# EAGLE design motor_updated_v2.0 (EAGLE 7.5.0)
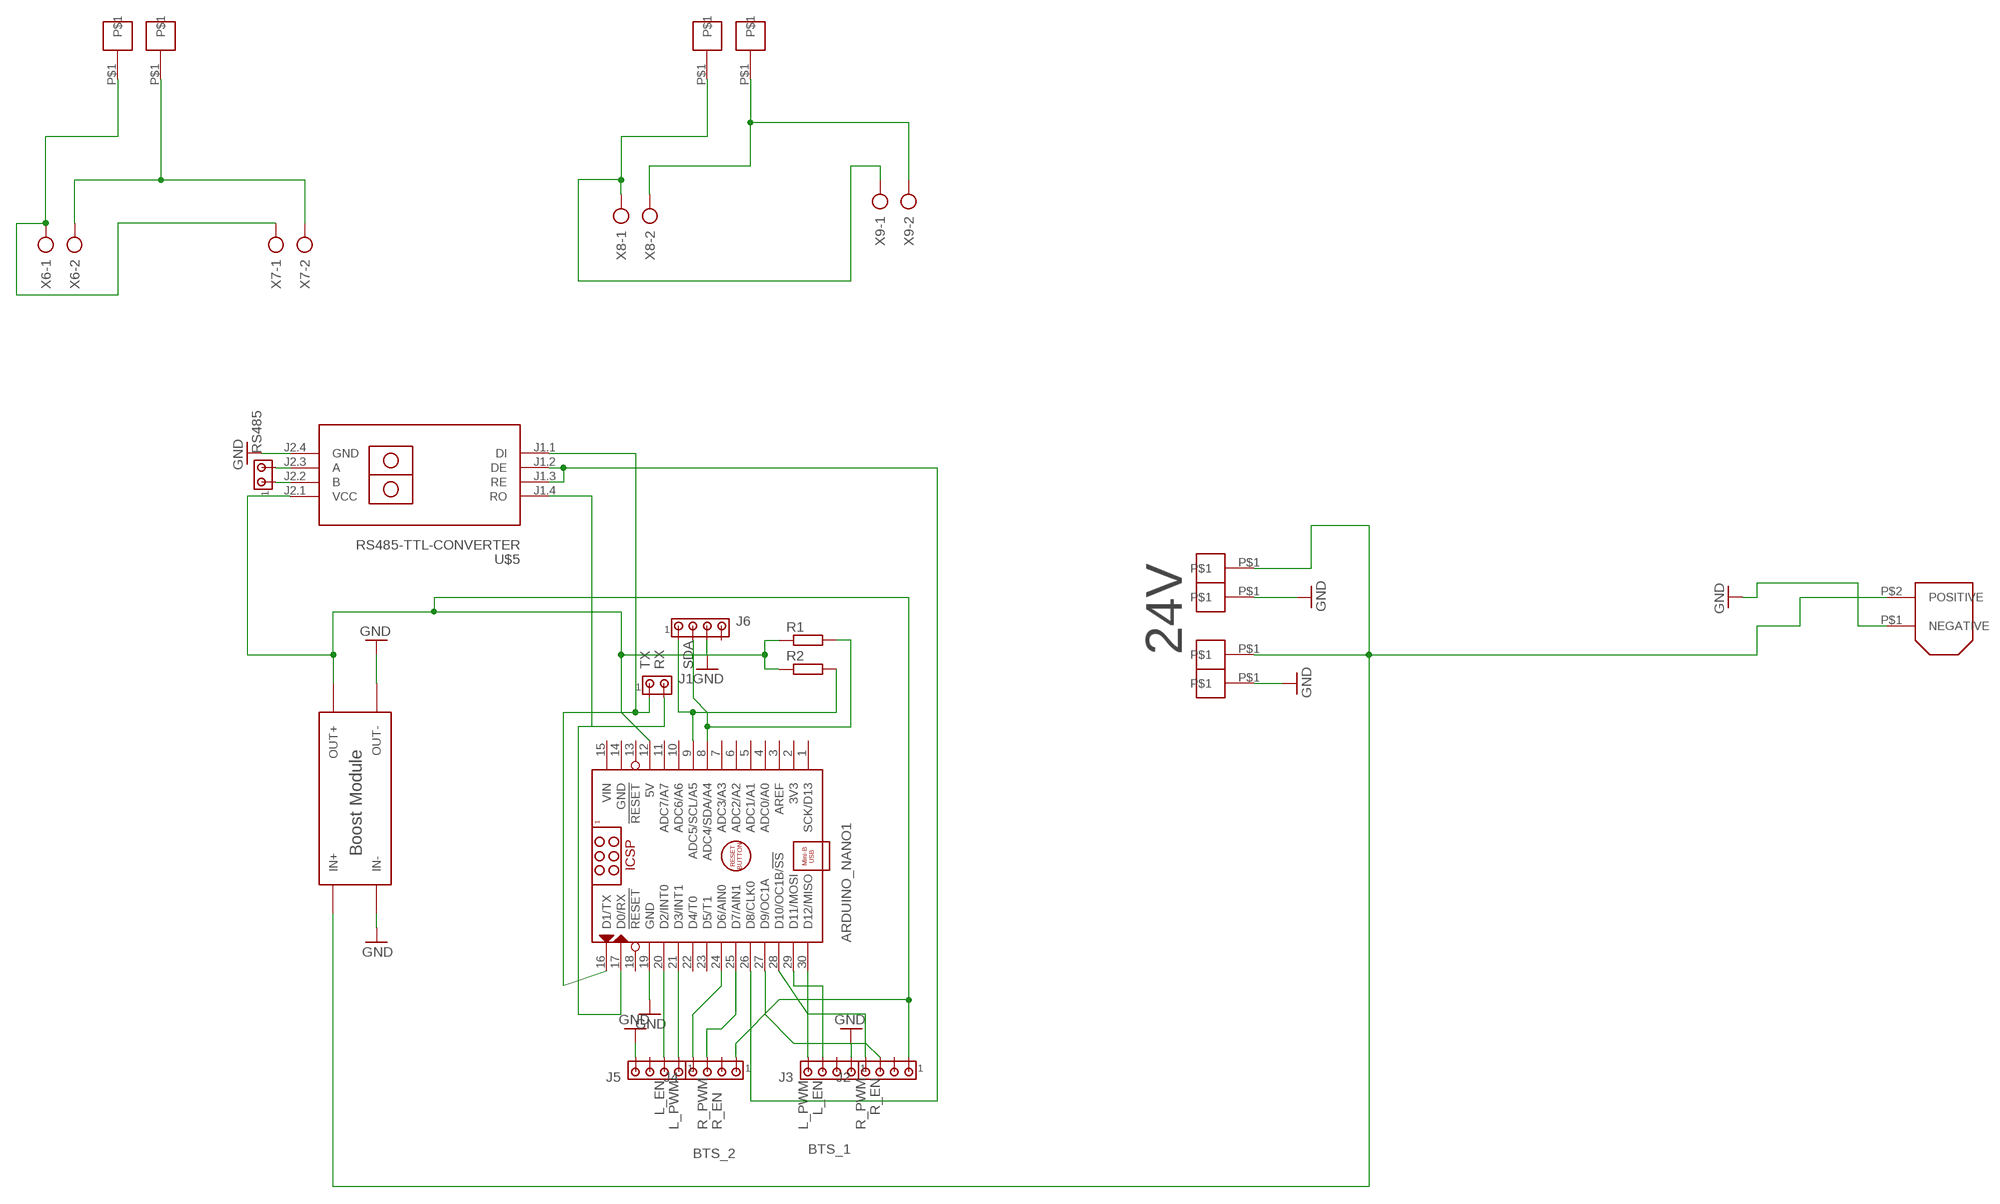
[diagram p0: schematic, sheet 1]

## Parts
ARDUINO_NANO1  ARDUINO_NANO  [ARDUINO_NANO]
J1  MTA02-100  [10X02MTA]
J2  MTA04-100  [10X04MTA]
J3  MTA04-100  [10X04MTA]
J4  MTA04-100  [10X04MTA]
J5  MTA04-100  [10X04MTA]
J6  MTA04-100  [10X04MTA]
R1  R-EU_0204/7  [0204/7]
R2  R-EU_0204/7  [0204/7]
RS485  MTA02-100  [10X02MTA]
U$4  BOOST_MODULE  [BOOST_MODULE]
U$5  RS485-TTL-CONVERTER  [RS485-TTL-CONVERTER]
U$6  VIA  [VIA]
U$7  XT60  [CONNECTOR]
U$8  VIA  [VIA]
U$9  VIA  [VIA]
U$12  VIA  [VIA]
U$13  VIA  [VIA]
U$14  VIA  [VIA]
U$15  VIA  [VIA]
U$23  VIA  [VIA]
X6  AK300/2  [AK300/2]
X7  AK300/2  [AK300/2]
X8  AK300/2  [AK300/2]
X9  AK300/2  [AK300/2]

## Nets
GND: ARDUINO_NANO1.19(GND) J3.1 J5.4 J6.3 U$4.IN- U$4.OUT- U$5.J2.4(GND) U$6.P$1 U$7.P$1(NEGATIVE) U$9.P$1
N$2: ARDUINO_NANO1.12(5V) J2.1 J4.1 R1.1 R2.1 U$4.OUT+ U$5.J2.1(VCC)
N$4: ARDUINO_NANO1.9(ADC5/SCL/A5) J6.1 R2.2
N$5: ARDUINO_NANO1.20(D2/INT0) J5.2
N$6: ARDUINO_NANO1.21(D3/INT1) J5.1
N$8: ARDUINO_NANO1.25(D7/AIN1) J4.3
N$9: ARDUINO_NANO1.24(D6/AIN0) J4.4
N$10: ARDUINO_NANO1.30(D12/MISO) J3.4
N$11: ARDUINO_NANO1.26(D8/CLK0) U$5.J1.2(DE) U$5.J1.3(RE)
N$12: U$4.IN+ U$7.P$2(POSITIVE) U$8.P$1 U$23.P$1
N$13: ARDUINO_NANO1.29(D11/MOSI) J3.3
N$14: RS485.2 U$5.J2.3(A)
N$16: RS485.1 U$5.J2.2(B)
N$17: ARDUINO_NANO1.28(D10/OC1B/!SS) J2.4
N$18: ARDUINO_NANO1.8(ADC4/SDA/A4) J6.2 R1.2
N$19: ARDUINO_NANO1.17(D0/RX) J1.2 U$5.J1.4(RO)
N$20: ARDUINO_NANO1.16(D1/TX) J1.1 U$5.J1.1(DI)
N$23: ARDUINO_NANO1.27(D9/OC1A) J2.3
N$25: U$12.P$1 X6.1 X7.1
N$28: U$14.P$1 X8.1 X9.1
N$45: U$13.P$1 X6.2 X7.2
N$47: U$15.P$1 X8.2 X9.2
Unconnected: ARDUINO_NANO1.1(SCK/D13) ARDUINO_NANO1.2(3V3) ARDUINO_NANO1.3(AREF) ARDUINO_NANO1.4(ADC0/A0) ARDUINO_NANO1.5(ADC1/A1) ARDUINO_NANO1.6(ADC2/A2) ARDUINO_NANO1.7(ADC3/A3) ARDUINO_NANO1.10(ADC6/A6) ARDUINO_NANO1.11(ADC7/A7) ARDUINO_NANO1.13(!RESET) ARDUINO_NANO1.18(!RESET) ARDUINO_NANO1.22(D4/T0) ARDUINO_NANO1.23(D5/T1) J2.2 J3.2 J4.2 J5.3 J6.4

## Notes on the sheet
- 24V
- TX | RX | SDA
- L_EN | L_EN | R_EN
- L_PWM | R_PWM | R_EN | L_PWM | R_PWM
- BTS_1
- BTS_2

## Power pins joined to a net without a drawn wire
GND: ARDUINO_NANO1.14(GND)
VIN: ARDUINO_NANO1.15(VIN)

## Library data of the parts
ARDUINO_NANO1 = ArduinoNanoV30:ARDUINO_NANO: Arduino Nano V3.0 Module Overview: The Arduino Nano is a small, complete, and breadboard-friendly board based on the ATmega328 (Arduino Nano 3.x) or ATmega168 (Arduino Nano 2.x). It has more or less the same functionality of the Arduino Duemilanove, but in a different package. It lacks only a DC power jack, and works with a Mini-B USB cable instead of a standard one. The Nano was designed and is being produced by Gravitech <http://www.gravitech.us/arna30wiatp.html>. General specifications: Item Value Microcontroller Atmel ATmega168 or ATmega328 Operating Voltage (logic level) 5 V Input Voltage (recommended) 7-12 V Input Voltage (limits) 6-20 V Digital I/O Pins 14 (of which 6 provide PWM output) Analog Input Pins 8 DC Current per I/O Pin 40 mA Flash Memory 16 KB (ATmega168) or 32 KB (ATmega328) of which 2 KB used by bootloader SRAM 1 KB (ATmega168) or 2 KB (ATmega328) EEPROM 512 bytes (ATmega168) or 1 KB (ATmega328) Clock Speed 16 MHz Dimensions (Inches) 0.73" x 1.70" Dimensions (mm) 18mm x 45mm Overall height About 9 mm (not including pins) Weigth 5 g Power: The Arduino Nano can be powered via the Mini-B USB connection, 6-20V unregulated external power supply (pin 30), or 5V regulated external power supply (pin 27). The power source is automatically selected to the highest voltage source. Memory: The ATmega168 has 16 KB of flash memory for storing code (of which 2 KB is used for the bootloader); the ATmega328 has 32 KB, (also with 2 KB used for the bootloader). The ATmega168 has 1 KB of SRAM and 512 bytes of EEPROM (which can be read and written with the EEPROM library); the ATmega328 has 2 KB of SRAM and 1 KB of EEPROM. Input and Output: Each of the 14 digital pins on the Nano can be used as an input or output, using pinMode(), digitalWrite(), and digitalRead() functions. They operate at 5 volts. Each pin can provide or receive a maximum of 40 mA and has an internal pull-up resistor (disconnected by default) of 20-50 kOhms. In addition, some pins have specialized functions. Visit Arduino - ArduinoBoardNano <https://www.arduino.cc/en/Main/ArduinoBoardNano>
J1 RS485 = con-amp:MTA02-100: AMP connector
J2-J6 = con-amp:MTA04-100: AMP connector
R1 R2 = rcl:R-EU_: RESISTOR, European symbol
U$4 = Boost Module:BOOST_MODULE
U$5 = diy-modules:RS485-TTL-CONVERTER: RS485 to TTL converter based on MAX485 chip
U$6 U$8 U$9 U$12-U$15 U$23 = via:VIA
U$7 = xt60_V2:XT60
X6-X9 = con-ptr500:AK300/2: CONNECTOR; OC_FARNELL: unknown; OC_NEWARK: unknown

## Board
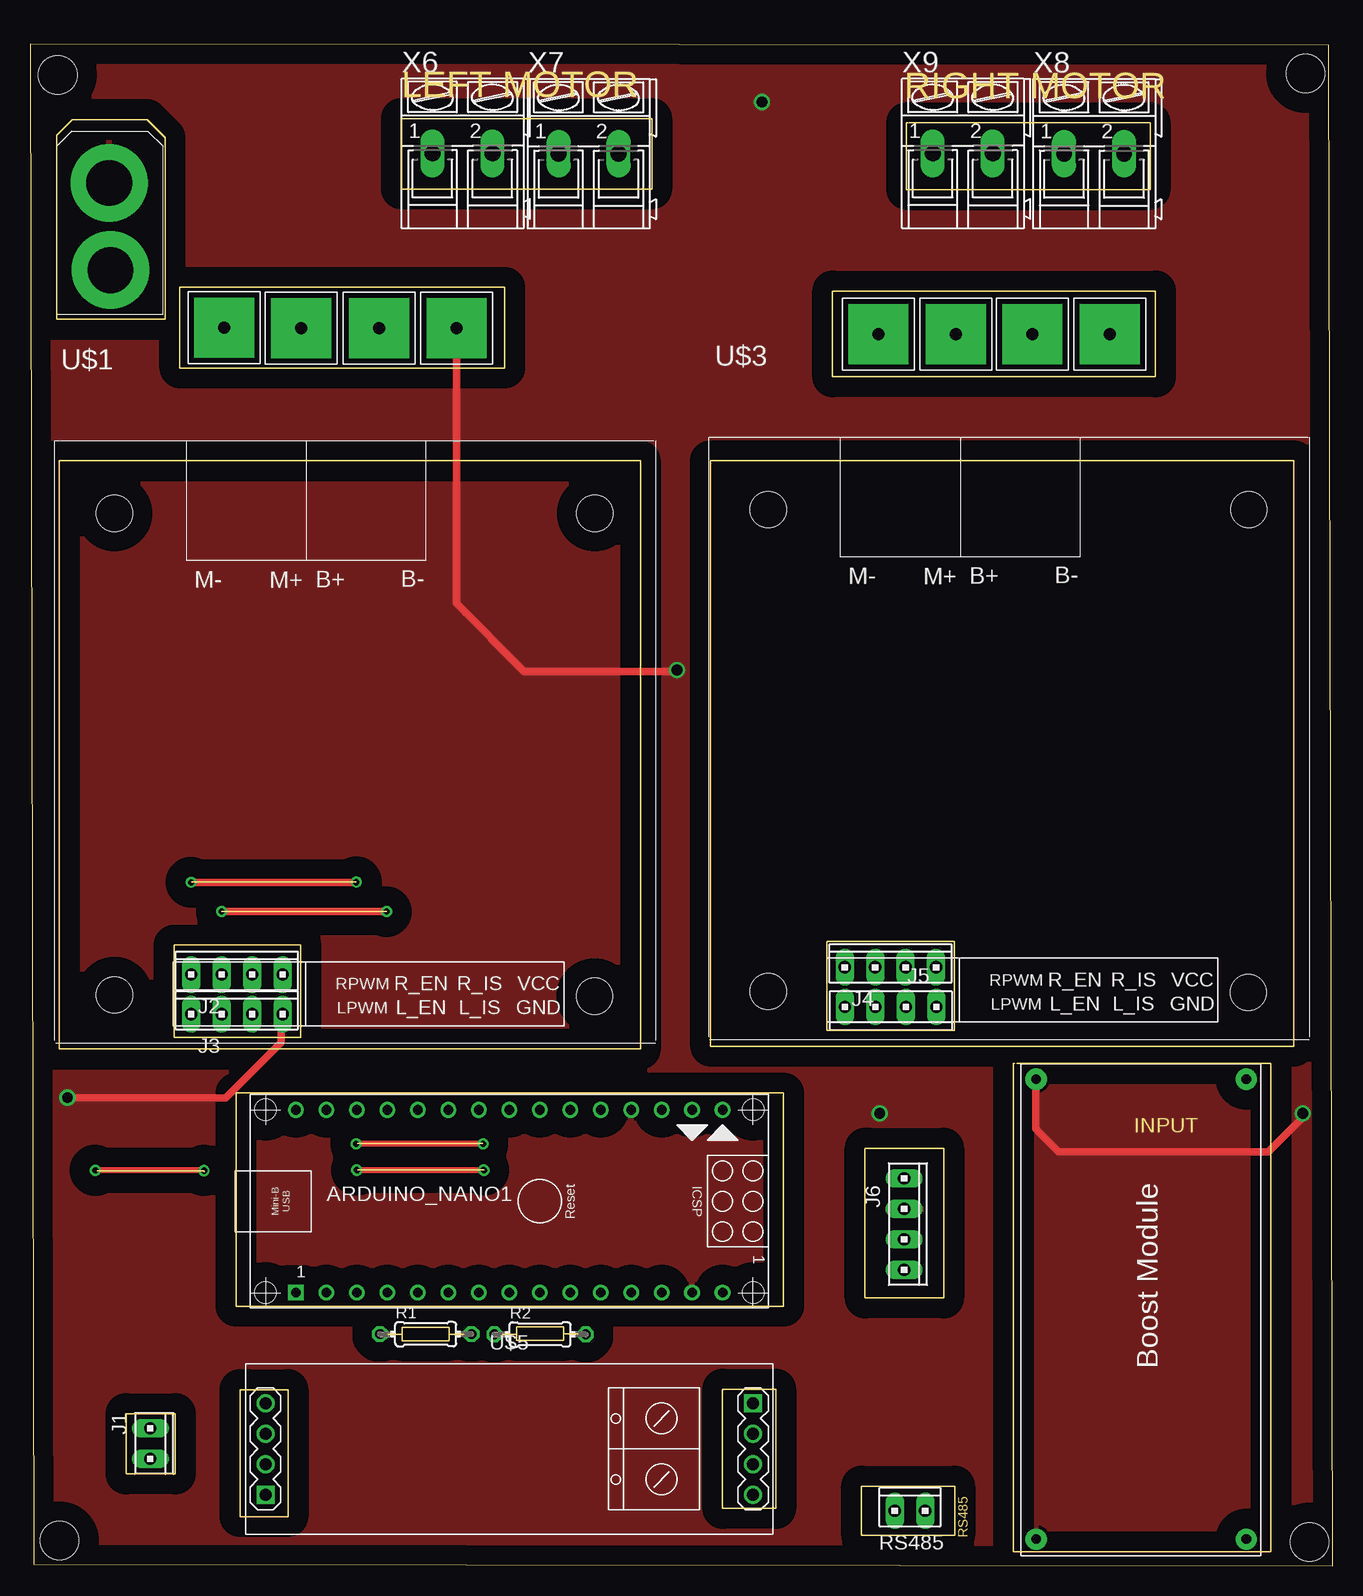
[diagram p1: board, top side]
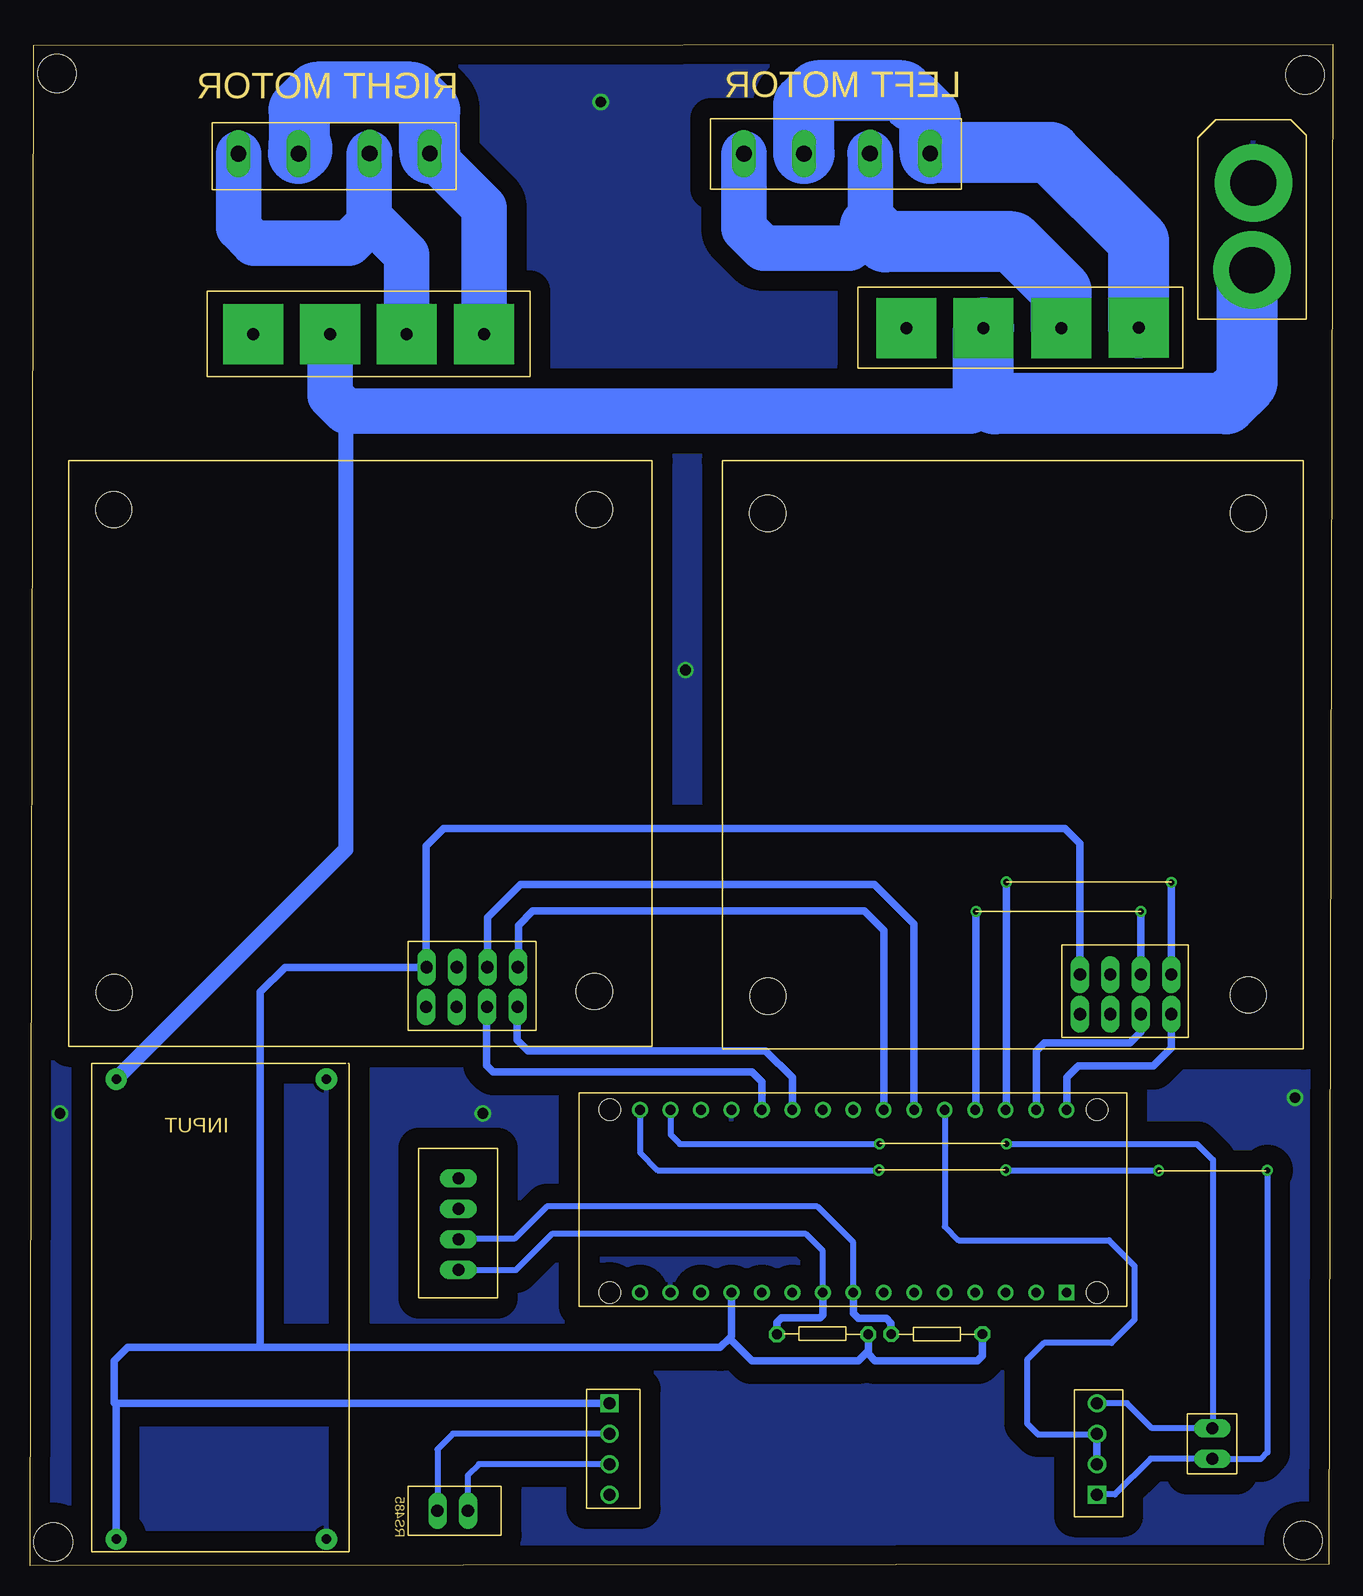
[diagram p2: board, bottom side, seen from below]

Size 108.59 x 126.85 mm. Coordinates in mm from the lower left corner, seen from the top.
Outline: 29.85,19.28 31.01,19.28
Outline: 31.01,19.28 31.01,19.89 34.92,19.89 34.92,19.3
Outline: 34.92,19.3 36.14,19.3
Outline: 31.01,19.28 31.01,18.74 34.92,18.74 34.92,19.3
Outline: 39.39,19.3 40.56,19.3
Outline: 40.56,19.3 40.56,19.91 44.47,19.91 44.47,19.33
Outline: 44.47,19.33 45.69,19.33
Outline: 40.56,19.3 40.56,18.77 44.47,18.77 44.47,19.33
Outline: 69.93,34.8 76.17,34.8 76.17,22.33 69.62,22.33 69.62,34.8 69.9,34.8
Outline: 73.25,120.29 93.4,120.29 93.4,114.71 73.08,114.71 73.08,120.29 73.18,120.29
Outline: 66.45,52.04 77.06,52.04 77.06,44.63 66.42,44.63 66.42,52.04
Outline: 18.09,14.68 21.51,14.68 21.51,4.09 17.5,4.09 17.5,14.68 18.11,14.68 18.11,14.66
Outline: 69.34,6.63 77.09,6.63 77.09,2.54 69.32,2.54 69.32,6.63
Outline: 13.46,57 27.18,57
Outline: 15.98,54.53 29.74,54.53
Outline: 5.59,32.89 14.53,32.89 14.53,32.84
Outline: 27.33,35.2 37.74,35.2
Outline: 27.31,32.99 37.85,32.99
Outline: 82.27,41.86 103.45,41.86 103.45,1.14 81.97,1.14 81.97,41.86 82.07,41.86
Outline: 2.56,92.1 50.88,92.1 50.88,43.08 2.44,43.08 2.44,92.1 2.54,92.1
Outline: 56.72,92.1 56.74,92.1
Outline: 56.74,92.1 105.36,92.1 105.36,43.31 56.74,43.31 56.74,92.1
Outline: 0.3,0.1 108.59,0 108.29,126.75 0,126.85 0.3,0.1
Outline: 8,12.67 12.12,12.67 12.12,7.65 8,7.65 8,12.67
Outline: 2.21,119.25 2.21,103.91 11.25,103.91 11.25,119.05 9.75,120.55 3.5,120.55 2.21,119.25
Outline: 30.96,120.62 51.84,120.62 51.84,114.76 30.96,114.76 30.96,120.62
Outline: 12.5,106.58 39.57,106.58 39.57,99.85 12.5,99.85 12.5,106.58
Outline: 66.9,106.25 93.83,106.25 93.83,99.11 66.9,99.11 66.9,106.25
Outline: 12.01,51.74 22.58,51.74 22.58,44.02 12.01,44.02 12.01,51.74
Outline: 57.73,14.71 62.18,14.71 62.18,4.77 57.73,4.77 57.73,14.71
Outline: 17.17,39.4 62.81,39.4 62.81,21.64 17.17,21.64 17.17,39.4
Copper layers (1*16): Top 0.035mm / dielectric 1.5mm / Bottom 0.035mm
Design rules "default": minimum track width 10mil, minimum drill 24mil, track to track 8mil, track to pad 8mil, pad to pad 8mil, via to via 8mil, smd to smd 8mil, copper to edge 40mil, drill to drill 8mil, minimum pad ring 10mil, minimum via ring 8mil, stop-mask expansion 4mil, vias tented up to drill 0mil, thermal gap 10mil
Holes 3.2 mm at 2.31,124.28 106.32,124.38 2.46,2.08 106.65,1.98

### Footprints (pad centres in the part's own frame; a part is rotated, then mirrored left to right if it is on the bottom)
ARDUINO_NANO = drill 0.8 square: 1 -20.32,-7.62 | drill 0.8: 2 -17.78,-7.62; 3 -15.24,-7.62; 4 -12.7,-7.62; 5 -10.16,-7.62; 6 -7.62,-7.62; 7 -5.08,-7.62; 8 -2.54,-7.62; 9 0,-7.62; 10 2.54,-7.62; 11 5.08,-7.62; 12 7.62,-7.62; 13 10.16,-7.62; 14 12.7,-7.62; 15 15.24,-7.62; 16 15.24,7.62; 17 12.7,7.62; 18 10.16,7.62; 19 7.62,7.62; 20 5.08,7.62; 21 2.54,7.62; 22 0,7.62; 23 -2.54,7.62; 24 -5.08,7.62; 25 -7.62,7.62; 26 -10.16,7.62; 27 -12.7,7.62; 28 -15.24,7.62; 29 -17.78,7.62; 30 -20.32,7.62 | hole 1.778: -22.86,-7.62; -22.86,7.62; 17.78,7.62; 17.78,-7.62
10X02MTA = drill 1.016 long: 1 1.27,0; 2 -1.27,0
10X04MTA = drill 1.016 long: 1 3.81,0; 2 1.27,0; 3 -1.27,0; 4 -3.81,0
0204/7 = drill 0.813 octagon: 1 -3.81,0; 2 3.81,0
IBT-2 = hole 3: -8.001,12.954; 32.055,12.954; 32.029,-27.305; -8.001,-27.203
BOOST_MODULE = drill 0.8 pad 1.778: IN+ 1.27,18.796; IN- 1.27,1.27; OUT+ 39.624,18.796; OUT- 39.624,1.27
RS485-TTL-CONVERTER = drill 1 square: J1.1 -20.32,-3.81; J2.1 20.32,3.81 | drill 1: J1.2 -20.32,-1.27; J1.3 -20.32,1.27; J1.4 -20.32,3.81; J2.2 20.32,1.27; J2.3 20.32,-1.27; J2.4 20.32,-3.81
VIA = drill 1 pad 5 square: P$1 -4,3
CONNECTOR = drill 3.81 pad 6.452: P$1 4.394,12.192; P$2 4.496,4.928
AK300/2 = drill 1.321 long: 1 -2.515,0; 2 2.489,0

### Placement (x,y rotation side)
ARDUINO_NANO1  42.49,30.38 0 top
J1  10.03,10.19 270 top
J2  17.25,49.28 0 top
J3  17.25,45.97 0 top
J4  71.73,49.89 0 top
J5  71.76,46.58 180 top
J6  72.87,28.47 270 top
R1  32.99,19.3 0 top
R2  42.52,19.28 0 top
RS485  73.36,4.57 0 top
U$1  [IBT-2]  15.04,74.78 0 top
U$3  [IBT-2]  69.55,75.08 0 top
U$4  82.6,41.83 270 top
U$5  39.95,9.73 0 top
U$6  94.01,99.67 0 top
U$7  2.21,103.07 0 top
U$8  33.1,100.18 0 top
U$9  39.55,100.18 0 top
U$12  20.17,100.2 0 top
U$13  26.62,100.18 0 top
U$14  74.73,99.67 0 top
U$15  81.18,99.67 0 top
U$23  87.58,99.67 0 top
X6  36.07,117.73 0 top
X7  46.58,117.7 0 top
X8  88.72,117.7 0 top
X9  77.77,117.73 0 top

### Tracks (layer width: path | path; a pad name or v marks a point on that pad's centre or on a via)
GND  (via drill 0.9 pad 1.27)
  Top 0.61: v3.12,39.01 16.33,39.01 20.95,43.64 20.95,45.87 J3.1 | U$4.IN- 83.87,36.4 85.78,34.49 103.23,34.49 106.27,37.54 105.94,37.54 105.87,37.62 106.02,37.62 106.07,37.67 | U$9.P$1 35.55,80.2 41.2,74.55 53.98,74.55 54.1,74.68 54.03,74.68 53.95,74.75 54.2,74.75 54.23,74.73
  other vias: 61.01,122.02 70.84,37.69 106.1,37.69 53.95,74.65
  pour Bottom (isolate 1.651): -4.47,130.51 112.5,129.69 112.5,-1.02 -4.47,-0.2
  pour Top (isolate 1.651): -1.55,131.47 112.85,130.84 112.85,-3.05 -1.55,-2.41
N$1  (via drill 0.5)
  other vias: 27.18,35.15
N$2
  Bottom 0.61: U$5.J2.1 101.52,13.54 | ARDUINO_NANO1.12 50.11,19.13 50.28,18.96 | 50.28,18.96 51.05,18.19 89.38,18.19 | 89.38,18.19 100.46,18.19 101.55,17.09 101.55,13.56 101.52,13.54 | 89.38,18.19 89.38,47.83 87.33,49.89 J4.1 75.56,49.91 75.56,59.99 74.09,61.47 22.33,61.47 21.06,60.2 J2.1 | U$4.OUT+ 101.4,13.41 101.52,13.54 | R1.1 29.18,17.5 29.59,17.09 38.15,17.09 38.71,17.65 R2.1 38.71,17.93 39.55,17.09 48.41,17.09 50.28,18.96
N$3  (via drill 0.5)
  other vias: 37.82,32.99
N$4
  Bottom 0.508: ARDUINO_NANO1.9 42.49,26.24 43.92,27.66 65.08,27.66 68.1,24.64 72.85,24.64 J6.1
  Bottom 0.61: R2.2 46.33,20.27 45.95,20.65 42.75,20.65 42.49,20.9 ARDUINO_NANO1.9
N$5
  Bottom 0.61: ARDUINO_NANO1.20 47.57,40.33 48.41,41.17 69.98,41.17 70.51,41.71 70.51,46.56 J5.2
N$6
  Bottom 0.61: ARDUINO_NANO1.21 45.03,40.69 47.27,42.93 67.08,42.93 67.97,43.81 67.97,46.56 J5.1
N$7  (via drill 0.5)
  other vias: 27.23,32.99
N$8
  Bottom 0.61: J4.3 70.46,54.03 67.69,56.79 38.2,56.79 34.9,53.49 34.9,38.02 ARDUINO_NANO1.25
N$9
  Bottom 0.61: ARDUINO_NANO1.24 37.41,52.93 39.04,54.56 66.67,54.56 67.87,53.37 67.87,49.94 J4.4
N$10
  Bottom 0.61: J3.4 13.44,43.18 14.96,41.66 21.18,41.66 22.15,40.69 22.15,38.02 ARDUINO_NANO1.30
N$11
  Bottom 0.508: ARDUINO_NANO1.26 32.33,28.27 31.19,27.13 18.64,27.13 16.51,24.99 16.51,20.5 18.44,18.57 24.05,18.57 25.48,17.14 25.48,11.86 24.56,10.95 19.68,10.95 U$5.J1.3
  Bottom 0.61: U$5.J1.2 U$5.J1.3
N$12
  Bottom 1.27: 82.27,96.24 82.27,59.69 U$4.IN+
  Bottom 3.81: U$23.P$1 83.58,97.55 82.27,96.24 30.18,96.24 28.55,97.87 28.55,98.22 28.25,98.53 29.06,98.53 29.11,98.58
  Bottom 5.08: U$8.P$1 29.11,103.17 29.11,98.58 29.11,97.76 28.19,96.85 8.89,96.85 7.11,98.63 7.11,107.59 U$7.P$2
N$13
  Bottom 0.61: J3.3 15.98,44.5 16.92,43.56 24.03,43.56 24.69,42.9 24.69,38.02 ARDUINO_NANO1.29
N$14
  Bottom 0.508: U$5.J2.3 71.17,8.46 72.11,7.52 72.11,4.6 RS485.2
N$16
  Bottom 0.508: U$5.J2.2 73.33,11 74.62,9.7 RS485.1
N$17  (via drill 0.5)
  Top 0.61: v13.44,56.97 v27.2,56.97
  Bottom 0.61: J2.4 v13.44,56.97 | v27.2,56.97 27.2,38.05 ARDUINO_NANO1.28
N$18
  Bottom 0.508: J6.2 72.82,27.25 68.2,27.25 65.51,29.95 42.95,29.95 39.95,26.95 ARDUINO_NANO1.8
  Bottom 0.61: R1.2 36.81,20.19 37.21,20.6 39.52,20.6 39.95,21.03 ARDUINO_NANO1.8
N$19  (via drill 0.5)
  Top 0.508: v37.77,35.15 v27.2,35.15
  Bottom 0.508: ARDUINO_NANO1.17 55.19,35.94 54.41,35.15 v37.77,35.15 | v27.2,35.15 11.3,35.15 9.98,33.83 9.98,11.51 J1.2 15.06,11.46 17.14,13.54 U$5.J1.4
N$20  (via drill 0.5)
  Top 0.508: v37.85,32.97 v27.25,32.97 | v14.5,32.97 v5.44,32.97
  Bottom 0.508: ARDUINO_NANO1.16 57.73,34.44 56.26,32.97 v37.85,32.97 | v27.25,32.97 v14.5,32.97 | v5.44,32.97 5.44,9.45 5.99,8.89 10.01,8.89 J1.1 15.16,8.92 18.14,5.94 19.61,5.94 U$5.J1.1
N$21  (via drill 0.5)
  other vias: 27.2,57
N$22  (via drill 0.5)
  other vias: 14.5,32.92
N$23  (via drill 0.5)
  Top 0.61: v15.98,54.53 v29.72,54.53
  Bottom 0.61: J2.3 v15.98,54.53 | v29.72,54.53 29.72,38.07 ARDUINO_NANO1.27
N$24  (via drill 0.5)
  other vias: 5.46,32.94
N$25
  Bottom 5.08: U$12.P$1 16.17,110.45 23.52,117.8 33.48,117.8 X6.1 33.55,120.78 34.82,122.05 35,122.05 35.89,122.94 42.95,122.94 44.09,121.79 44.09,117.73 X7.1
N$28
  Bottom 3.81: U$14.P$1 70.73,113.2 X9.1
  Bottom 5.08: X9.1 75.26,121.31 76.76,122.81 84.71,122.81 86.16,121.36 86.16,118.47 85.93,118.24 85.93,117.98 X8.1
N$45
  Bottom 3.81: X6.2 38.53,117.7 38.53,111.58 40.28,109.83 47.45,109.83 49.07,111.45 X7.2
  Bottom 5.08: U$13.P$1 22.62,106.29 26.69,110.36 37.31,110.36 38.53,111.58
N$47
  Bottom 3.81: U$15.P$1 77.18,109.28 80.07,112.18 | 80.07,112.18 80.31,112.42 80.31,117.68 X9.2 | X8.2 91.21,111.53 89.94,110.26 81.99,110.26 80.07,112.18

### Text on the board
Dimension: LEFT MOTOR | RIGHT MOTOR | INPUT | RS485